# EAGLE design ZEROcard (EAGLE 6.5.0)
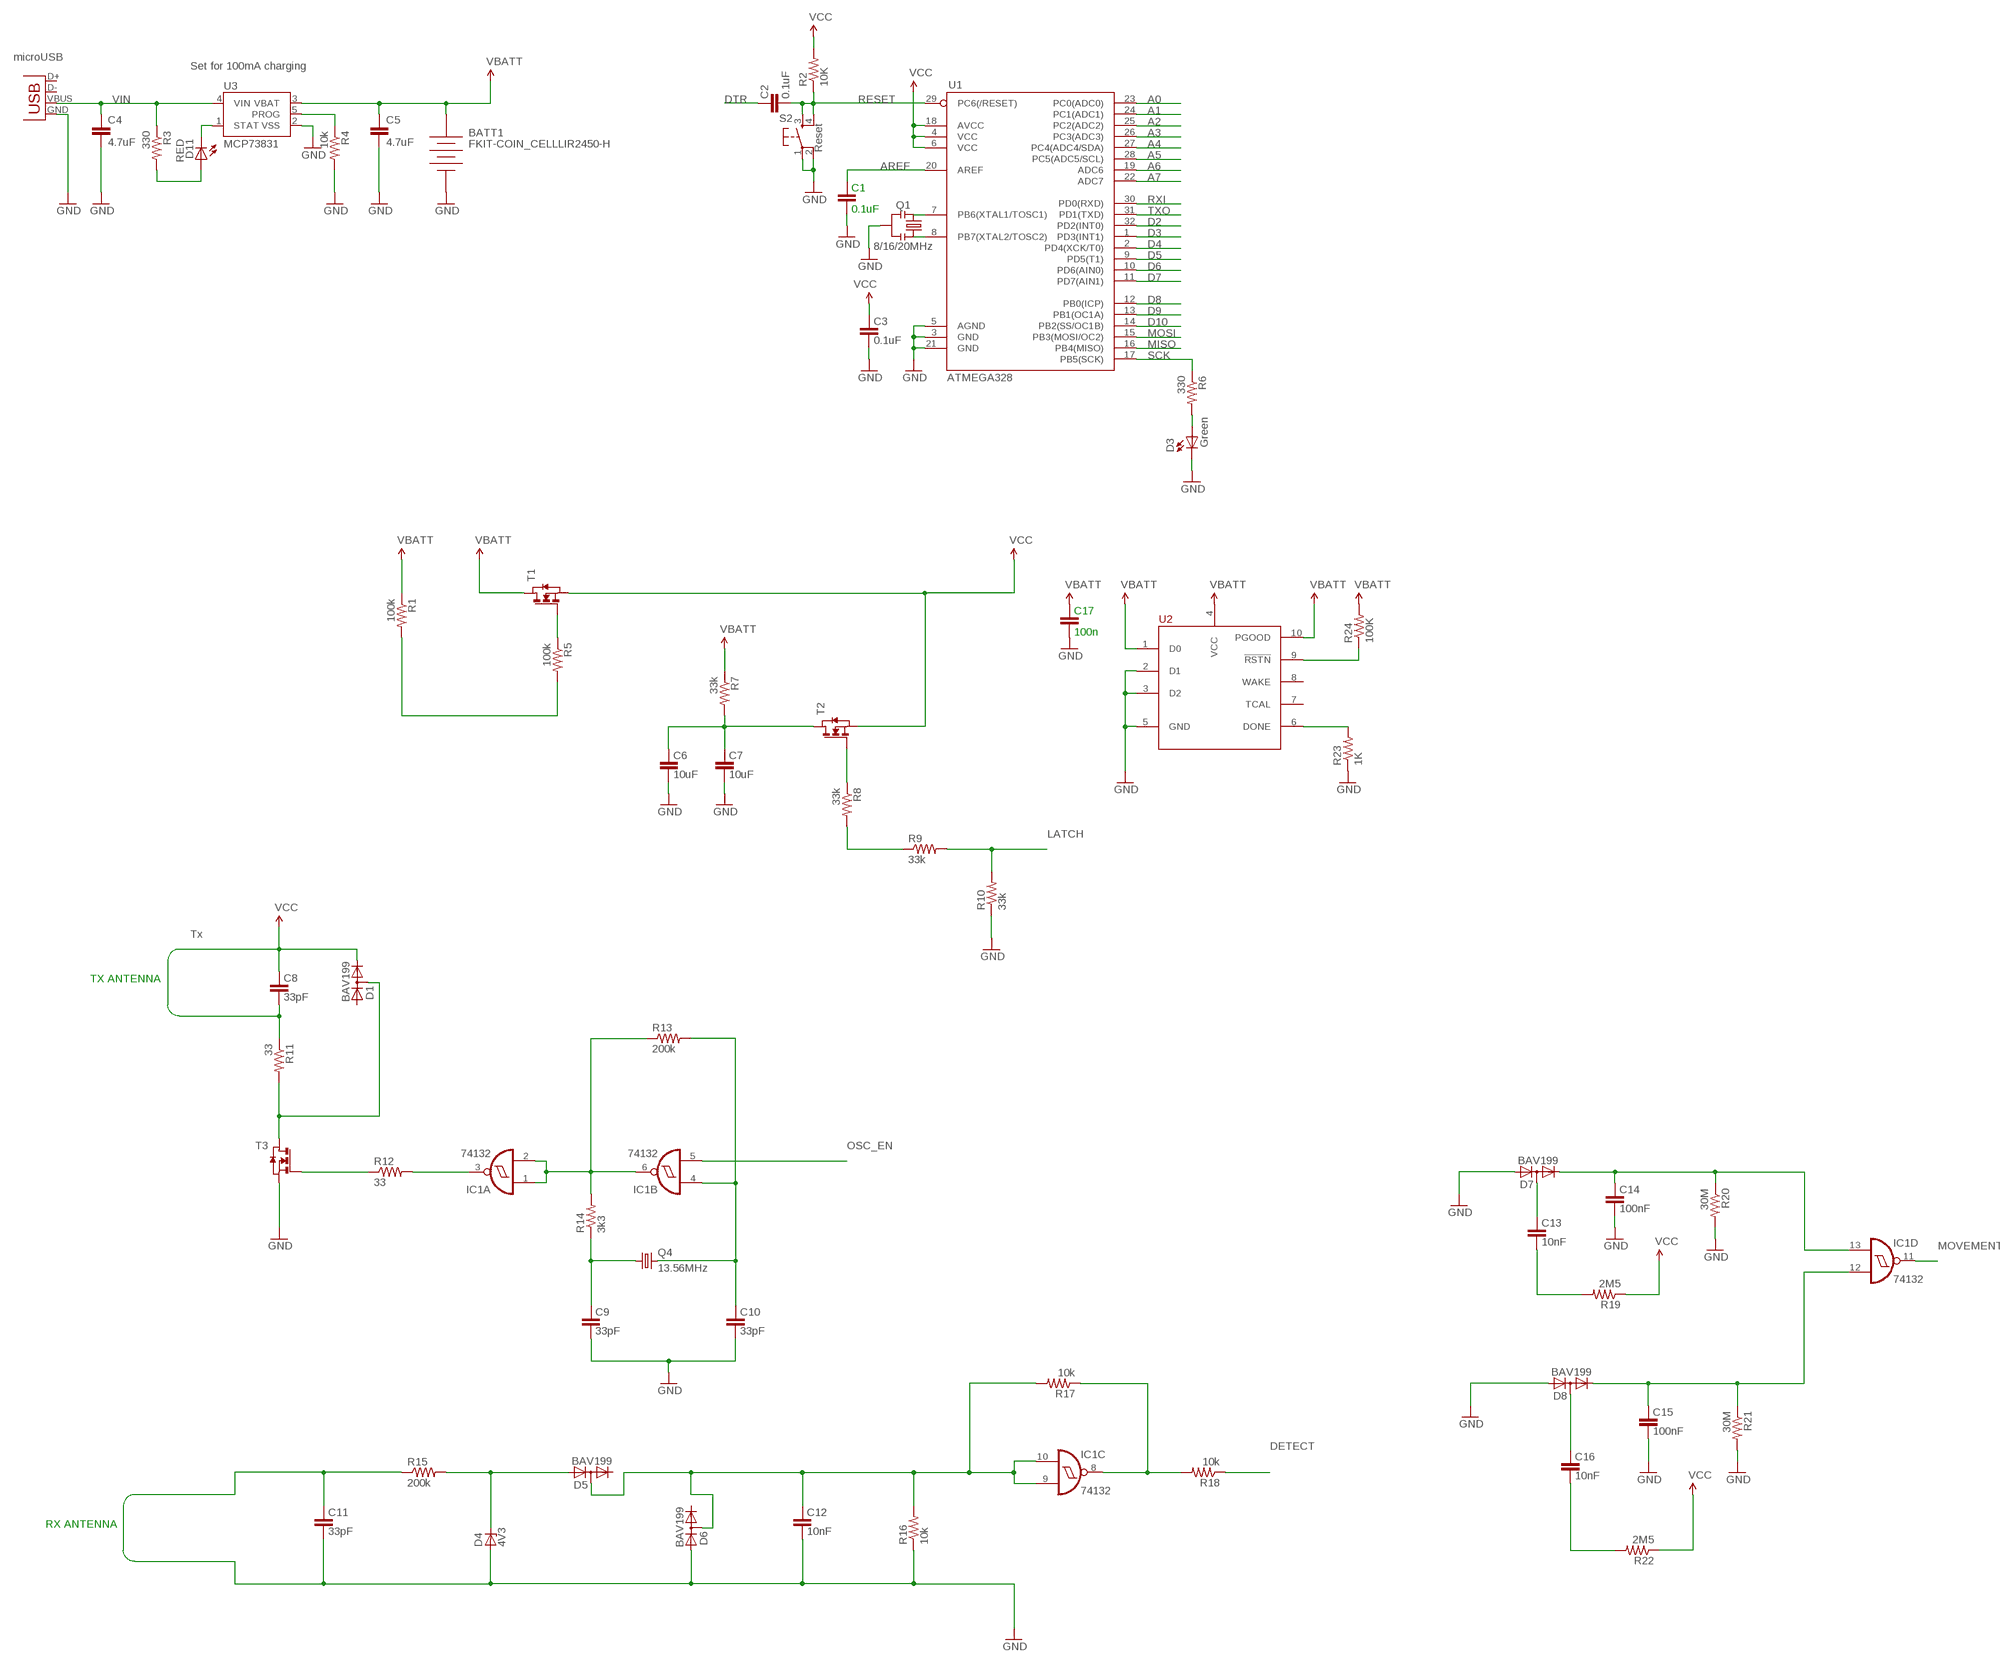
[diagram p0: schematic, sheet 1]

## Parts
BATT1  FKIT-COIN_CELLLIR2450-H  [FKIT-LIR2450-H]
C1  0.1uF  CAP0805  [0805]
C2  0.1uF  CAP0805  [0805]
C3  0.1uF  CAP0805  [0805]
C4  4.7uF  CAP0805  [0805]
C5  4.7uF  CAP0805  [0805]
C6  10uF  CAP0805  [0805]
C7  10uF  CAP0805  [0805]
C8  33pF  CAP0805  [0805]
C9  33pF  CAP0805  [0805]
C10  33pF  CAP0805  [0805]
C11  33pF  CAP0805  [0805]
C12  10nF  CAP0805  [0805]
C13  10nF  CAP0805  [0805]
C14  100nF  CAP0805  [0805]
C15  100nF  CAP0805  [0805]
C16  10nF  CAP0805  [0805]
C17  100n  CAP0805  [0805]
D1  BAV199  [SOT23]
D3  Green  LED0603  [LED-0603]
D4  4V3  ZENER-DIODESOT23  [SOT23]
D5  BAV199  [SOT23]
D6  BAV199  [SOT23]
D7  BAV199  [SOT23]
D8  BAV199  [SOT23]
D11  RED  LED0603  [LED-0603]
IC1  74132  [TSSOP14]
Q1  8/16/20MHz  RESONATORSMD  [RESONATOR-SMD]
Q4  13.56MHz  MC-306  [MC-306]
R1  100k  RESISTOR0805-RES  [0805]
R2  10K  RESISTOR0805-RES  [0805]
R3  330  RESISTOR0805-RES  [0805]
R4  10k  RESISTOR0805-RES  [0805]
R5  100k  RESISTOR0805-RES  [0805]
R6  330  RESISTOR0805-RES  [0805]
R7  33k  RESISTOR0805-RES  [0805]
R8  33k  RESISTOR0805-RES  [0805]
R9  33k  RESISTOR0805-RES  [0805]
R10  33k  RESISTOR0805-RES  [0805]
R11  33  RESISTOR0805-RES  [0805]
R12  33  RESISTOR0805-RES  [0805]
R13  200k  RESISTOR0805-RES  [0805]
R14  3k3  RESISTOR0805-RES  [0805]
R15  200k  RESISTOR0805-RES  [0805]
R16  10k  RESISTOR0805-RES  [0805]
R17  10k  RESISTOR0805-RES  [0805]
R18  10k  RESISTOR0805-RES  [0805]
R19  2M5  RESISTOR0805-RES  [0805]
R20  30M  RESISTOR0805-RES  [0805]
R21  30M  RESISTOR0805-RES  [0805]
R22  2M5  RESISTOR0805-RES  [0805]
R23  1K  RESISTOR0805-RES  [0805]
R24  100K  RESISTOR0805-RES  [0805]
S2  Reset  TAC_SWITCHSMD  [TACTILE_SWITCH_SMD]
T1  NMOSSOT23  [SOT-23]
T2  NMOSSOT23  [SOT-23]
T3  NMOSSOT23  [SOT-23]
U1  ATMEGA328  ATMEGA168  [TQFP32-08]
U2  TPL5000  [MSOP10]
U3  MCP73831  [SOT23-5]
X1  Micro USB  USB-MICROB  [USB-MICROB]

## Nets
3.3V: BATT1.POS C5.1 C8.1 C8.2 C17.2 D1.2(C) R1.1 R7.1 R11.1 R19.1 R22.1 R24.2 T1.1(D) T1.2(S) T2.2(S) U2.1(D0) U2.4(VCC) U2.10(PGOOD) U3.3(VBAT) ; supply symbol labelled VBATT, VCC
A0: U1.23(PC0(ADC0))
A1: U1.24(PC1(ADC1))
A2: U1.25(PC2(ADC2))
A3: U1.26(PC3(ADC3))
A4: U1.27(PC4(ADC4/SDA))
A5: U1.28(PC5(ADC5/SCL))
A6: U1.19(ADC6)
A7: U1.22(ADC7)
AREF: C1.2 U1.20(AREF)
D2: U1.32(PD2(INT0))
D3: U1.1(PD3(INT1))
D4: U1.2(PD4(XCK/T0))
D5: U1.9(PD5(T1))
D6: U1.10(PD6(AIN0))
D7: U1.11(PD7(AIN1))
D8: U1.12(PB0(ICP))
D9: U1.13(PB1(OC1A))
D10: U1.14(PB2(SS/OC1B))
DETECT: R18.1
DTR: C2.2
GND [vcc]: BATT1.NEG C1.1 C3.1 C4.2 C5.2 C6.1 C7.1 C9.1 C10.1 C14.1 C15.1 C17.1 D3.C D7.1(A) D8.1(A) Q1.2 R4.2 R10.1 R20.2 R21.2 R23.1 S2.1 S2.2 T3.2(S) U1.3(GND) U1.5(AGND) U1.21(GND) U2.2(D1) U2.3(D2) U2.5(GND) U3.2(VSS) X1.GND
LATCH: R9.2 R10.2
MISO: U1.16(PB4(MISO))
MOSI: U1.15(PB3(MOSI/OC2))
MOVEMENT: IC1.11(D:O)
N$1: Q1.1 U1.8(PB7(XTAL2/TOSC2))
N$2: Q1.3 U1.7(PB6(XTAL1/TOSC1))
N$3: D11.A R3.2
N$4: R1.2 R5.2
N$7: D3.A R6.2
N$8: R5.1 T1.3(G)
N$9: C6.2 C7.2 R7.2 T2.1(D)
N$10: R8.2 R9.1
N$11: C9.2 Q4.1 R14.1
N$12: R8.1 T2.3(G)
N$13: R23.2 U2.6(DONE)
N$14: D1.3(AC) R11.2 T3.1(D)
N$15: D4.3(C) D5.1(A) R15.2
N$16: R12.1 T3.3(G)
N$17: IC1.3(A:O) R12.2
N$18: IC1.1(A:I0) IC1.2(A:I1) IC1.6(B:O) R13.1 R14.2
N$19: C13.2 D7.3(AC)
N$20: C10.2 IC1.4(B:I0) Q4.4 R13.2
N$21: C12.2 D5.3(AC) D6.3(AC) IC1.9(C:I1) IC1.10(C:I0) R16.2 R17.2
N$22: C13.1 R19.2
N$23: C14.2 D7.2(C) IC1.13(D:I0) R20.1
N$24: IC1.8(C:O) R17.1 R18.2
N$25: C15.2 D8.2(C) IC1.12(D:I1) R21.1
N$26: C16.2 D8.3(AC)
N$27: C16.1 R22.2
N$28: R24.1 U2.9(!RSTN)
OSC_EN: IC1.5(B:I1)
PROG: R4.1 U3.5(PROG)
RESET: C2.1 R2.1 S2.3 S2.4 U1.29(PC6(/RESET))
RX [vcc]: C11.1 C11.2 C12.1 D4.1(A) D6.1(A) R15.1 R16.1 ; supply symbol labelled GND
RXI: U1.30(PD0(RXD))
SCK: R6.1 U1.17(PB5(SCK))
STAT: D11.C U3.1(STAT)
TXO: U1.31(PD1(TXD))
VCC: C3.2 R2.2 U1.4(VCC) U1.6(VCC) U1.18(AVCC)
VIN: C4.1 R3.1 U3.4(VIN) X1.VBUS
Unconnected: D1.1(A) D5.2(C) D6.2(C) U2.7(TCAL) U2.8(WAKE) X1.D+ X1.D-

## Notes on the sheet
- microUSB
- Set for 100mA charging
- Tx
- TX ANTENNA
- RX ANTENNA

## Power pins joined to a net without a drawn wire
GND: IC1.7(P:GND)
VCC: IC1.14(P:VCC)

## Library data of the parts
BATT1 = SparkFun-Electromechanical:FKIT-COIN_CELL: Fabrick.it Coin Cell Holder Coin cell holder for 24.5mm rechargable coin cell
C1-C17 = SparkFun:CAP: Capacitor Standard 0603 ceramic capacitor, and 0.1" leaded capacitor.
D1 D5-D8 = diode:BAV199: DIODE low-leakage double diode
D3 D11 = SparkFun:LED: LEDs Standard schematic elements and footprints for 5mm, 3mm, 1206, and 0603 sized LEDs. 5mm - Spark Fun Electronics SKU : COM-00529 (and others)
D4 = diode:ZENER-DIODE: Z-Diode
IC1 = 74xx-eu:74*132: Quad 2-input NAND schmitt trigger
Q1 = SparkFun:RESONATOR: Resonator Small SMD resonator. This is the itty bitty 10/20MHz resonators with built in caps. CSTCE10M0G55 and CSTCE20M0V53. Footprint has been reviewed closely but hasn't been tested yet.
Q4 = crystal:MC-306: kHz RANGE CRYSTAL UNIT SMD Source: MC-306_405_406_E07X.PDF Homepage <http://www.epsontoyocom.co.jp>; MPN: MC-306 60.0KHZ 100PPM ,12.5PF; OC_FARNELL: 1278040; OC_NEWARK: 31M5576
R1-R24 = SparkFun:RESISTOR: Resistor Basic schematic elements and footprints for 0603, 1206, and PTH resistors.
S2 = SparkFun:TAC_SWITCH: Momentary Switch Button commonly used for reset or general input. Spark Fun Electronics SKU : COM-00097
T1-T3 = zetex:NMOSSOT23: MOS FET; OC_FARNELL: unknown; OC_NEWARK: unknown
U1 = SparkFun:ATMEGA168
U2 = reozenLib:TPL5000: Timer Low Power (2, 4, 8, ... 64 seconds wake up time) http://www.ti.com/lit/ds/symlink/tpl5000.pdf
U3 = SparkFun:MCP73831: Microchip's MCP73831 Miniature single cell, fully integrated Li-Ion, Li-polymer charge management controller http://ww1.microchip.com/downloads/en/DeviceDoc/21984a.pdf
X1 = SparkFun:USB: USB Connectors USB-B-PTH is fully proven SKU : PRT-00139 USB-miniB is fully proven SKU : PRT-00587 USB-A-PCB is untested. USB-A-H is throughly reviewed, but untested. Spark Fun Electronics SKU : PRT-00437 USB-B-SMT is throughly reviewed, but untested. Needs silkscreen touching up. USB-A-S has not been used/tested USB-MB-H has not been used/tested

## Net classes
1 vcc: width 0.254 mm

## Board
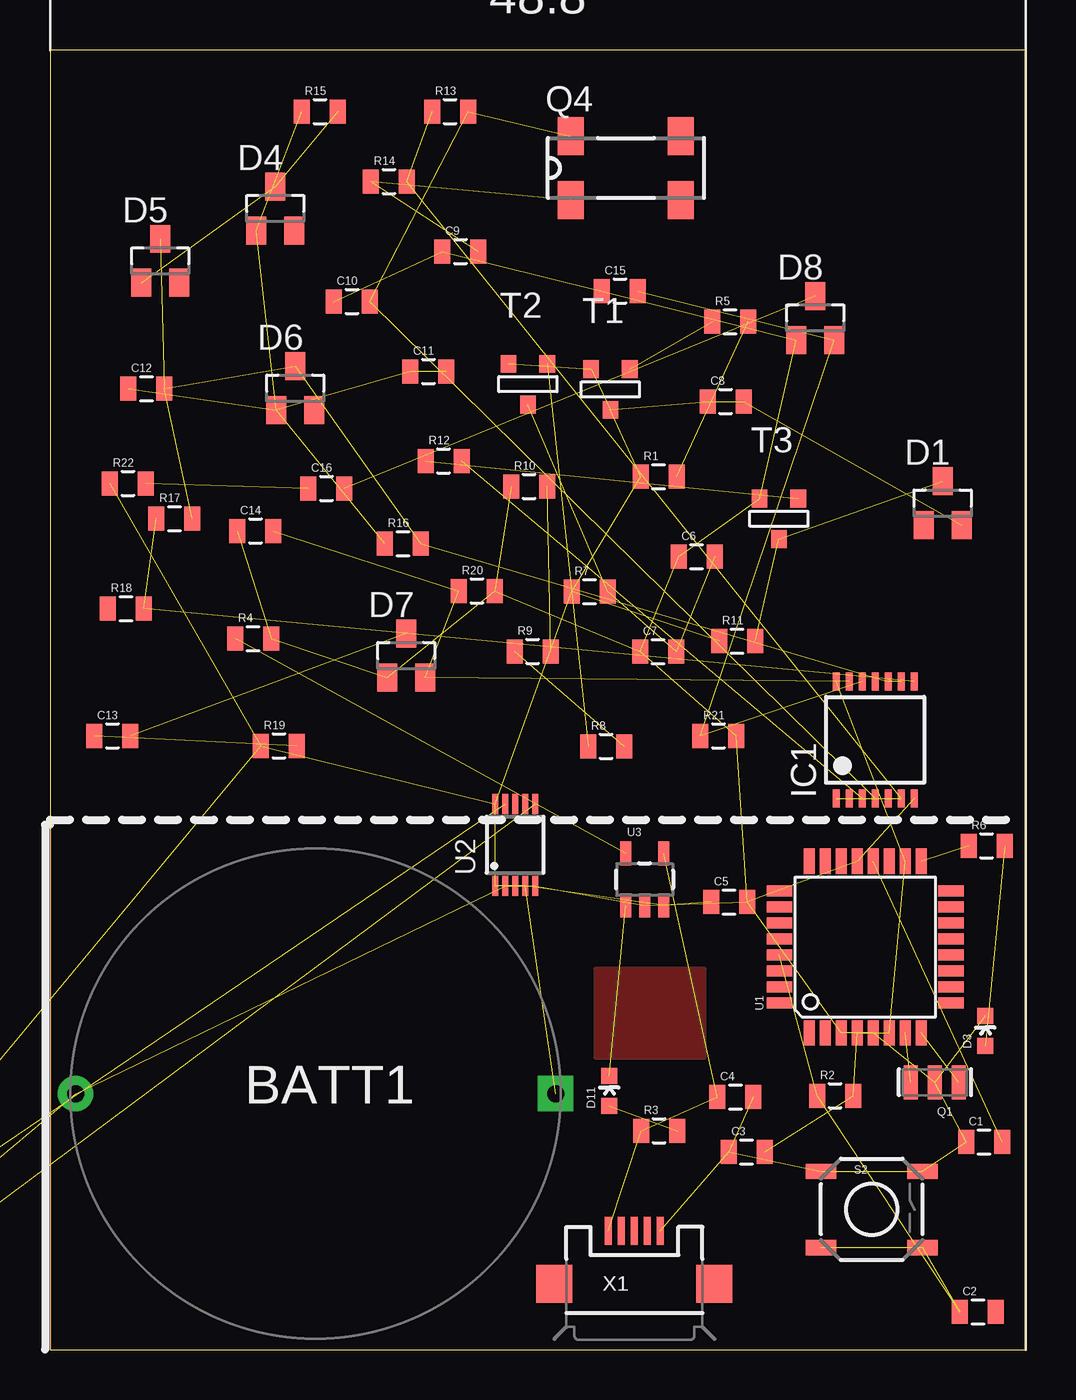
[diagram p1: board, top side]

Size 48.8 x 65 mm. Coordinates in mm from the lower left corner, seen from the top.
Outline: 0,0 48.8,0 48.8,65 0,65 0,0
Copper layers (1*16): Top 0.035mm / dielectric 1.5mm / Bottom 0.035mm
Design rules "default": minimum track width 10mil, minimum drill 24mil, track to track 8mil, track to pad 8mil, pad to pad 8mil, via to via 8mil, smd to smd 8mil, copper to edge 40mil, drill to drill 8mil, minimum pad ring 10mil, minimum via ring 8mil, stop-mask expansion 4mil, vias tented up to drill 0mil, thermal gap 10mil

### Footprints (pad centres in the part's own frame; a part is rotated, then mirrored left to right if it is on the bottom)
FKIT-LIR2450-H = drill 0.85 pad 1.778: NEG -12,0 | drill 0.85 pad 1.778 square: POS 12,0
0805 = smd 0.8 x 1.2: 1 -0.9,0; 2 0.9,0
SOT23 = smd 1 x 1.4: 1 -0.95,-1.1; 2 0.95,-1.1; 3 0,1.1
LED-0603 = smd 0.8 x 0.8: A 0,-0.75; C 0,0.75
TSSOP14 = smd 0.35 x 0.9: 1 -1.95,-2.925; 2 -1.3,-2.925; 3 -0.65,-2.925; 4 0,-2.925; 5 0.65,-2.925; 6 1.3,-2.925; 7 1.95,-2.925; 8 1.95,2.925; 9 1.3,2.925; 10 0.65,2.925; 11 0,2.925; 12 -0.65,2.925; 13 -1.3,2.925; 14 -1.95,2.925
RESONATOR-SMD = smd 0.7 x 1.7: 1 -1.2,0; 2 0,0; 3 1.2,0
MC-306 = smd 1.3 x 1.9: 1 -2.75,-1.6; 2 2.75,-1.6; 3 2.75,1.6; 4 -2.75,1.6
TACTILE_SWITCH_SMD = smd 1.524 x 0.762: 1 -2.54,1.905; 2 2.54,1.905; 3 -2.54,-1.905; 4 2.54,-1.905
SOT-23 = smd 0.787 x 0.889: 1 0.025,-1.016; 2 -0.94,1.016; 3 0.991,1.016
TQFP32-08 = smd 1.27 x 0.559: 1 -4.293,2.8; 2 -4.293,2; 3 -4.293,1.2; 4 -4.293,0.4; 5 -4.293,-0.4; 6 -4.293,-1.2; 7 -4.293,-2; 8 -4.293,-2.8; 17 4.293,-2.8; 18 4.293,-2; 19 4.293,-1.2; 20 4.293,-0.4; 21 4.293,0.4; 22 4.293,1.2; 23 4.293,2; 24 4.293,2.8 | smd 0.559 x 1.27: 9 -2.8,-4.293; 10 -2,-4.293; 11 -1.2,-4.293; 12 -0.4,-4.293; 13 0.4,-4.293; 14 1.2,-4.293; 15 2,-4.293; 16 2.8,-4.293; 25 2.8,4.293; 26 2,4.293; 27 1.2,4.293; 28 0.4,4.293; 29 -0.4,4.293; 30 -1.2,4.293; 31 -2,4.293; 32 -2.8,4.293
MSOP10 = smd 0.3 x 1: 1 -1,-2.05; 2 -0.5,-2.05; 3 0,-2.05; 4 0.5,-2.05; 5 1,-2.05; 6 1,2.05; 7 0.5,2.05; 8 0,2.05; 9 -0.5,2.05; 10 -1,2.05
SOT23-5 = smd 0.55 x 1.2: 1 -0.95,-1.3; 2 0,-1.3; 3 0.95,-1.3; 4 0.95,1.3; 5 -0.95,1.3
USB-MICROB = smd 0.35 x 1.4: D+ 0,2.65; D- -0.65,2.65; GND 1.3,2.65; ID 0.65,2.65; VBUS -1.3,2.65 | smd 1.8 x 1.9: MT1 -4,0; MT2 4,0

### Placement (x,y rotation side)
BATT1  13.28,12.8 0 top
C1  46.7,10.38 0 top
C2  46.39,1.88 0 top
C3  34.83,9.88 0 top
C4  34.27,12.63 0 top
C5  33.96,22.38 0 top
C6  32.34,39.66 0 top
C7  30.41,34.91 0 top
C8  33.78,47.42 0 top
C9  20.52,54.92 0 top
C10  15.1,52.42 0 top
C11  18.92,48.92 0 top
C12  4.82,48.06 0 top
C13  3.12,30.69 0 top
C14  10.27,40.94 0 top
C15  28.5,52.94 0 top
C16  13.82,43.07 0 top
C17  -17,1.75 0 top  (outside the outline)
D1  44.63,42.34 0 top
D3  46.77,15.94 0 top
D4  11.27,57.07 0 top
D5  5.51,54.45 0 top
D6  12.27,48.08 0 top
D7  17.82,34.71 0 top
D8  38.27,51.59 0 top
D11  27.96,12.94 0 top
IC1  41.25,30.5 0 top
Q1  44.24,13.37 180 top
Q4  28.8,59.09 0 top
R1  30.43,43.66 0 top
R2  39.26,12.69 0 top
R3  30.45,10.94 0 top
R4  10.16,35.56 0 top
R5  34.01,51.41 0 top
R6  46.83,25.19 0 top
R7  26.98,37.91 0 top
R8  27.81,30.17 0 top
R9  24.14,34.92 0 top
R10  23.96,43.17 0 top
R11  34.36,35.44 0 top
R12  19.68,44.45 0 top
R13  20.01,61.92 0 top
R14  16.95,58.42 0 top
R15  13.49,61.92 0 top
R16  17.64,40.31 0 top
R17  6.22,41.56 0 top
R18  3.79,37.06 0 top
R19  11.45,30.19 0 top
R20  21.34,37.94 0 top
R21  33.42,30.69 0 top
R22  3.9,43.32 0 top
R23  -11,1.75 0 top  (outside the outline)
R24  -14,1.75 0 top  (outside the outline)
S2  41.08,7.01 0 top
T1  28,48.02 0 top
T2  23.87,48.28 0 top
T3  36.42,41.55 0 top
U1  40.76,20.13 90 top
U2  23.25,25.25 0 top
U3  29.73,23.51 0 top
X1  29.22,3.28 0 top

### Tracks (layer width: path | path; a pad name or v marks a point on that pad's centre or on a via)
3.3V  (18 unrouted)
AREF  (1 unrouted)
GND  (32 unrouted)
LATCH  (1 unrouted)
N$1  (1 unrouted)
N$2  (1 unrouted)
N$3  (1 unrouted)
N$4  (1 unrouted)
N$5
  pour Top: 27.27,19.05 27.27,14.61 32.73,14.61 32.73,19.05
N$7  (1 unrouted)
N$8  (1 unrouted)
N$9  (3 unrouted)
N$10  (1 unrouted)
N$11  (2 unrouted)
N$12  (1 unrouted)
N$13  (1 unrouted)
N$14  (2 unrouted)
N$15  (2 unrouted)
N$16  (1 unrouted)
N$17  (1 unrouted)
N$18  (4 unrouted)
N$19  (1 unrouted)
N$20  (3 unrouted)
N$21  (6 unrouted)
N$22  (1 unrouted)
N$23  (3 unrouted)
N$24  (2 unrouted)
N$25  (3 unrouted)
N$26  (1 unrouted)
N$27  (1 unrouted)
N$28  (1 unrouted)
PROG  (1 unrouted)
RESET  (4 unrouted)
RX  (6 unrouted)
SCK  (1 unrouted)
STAT  (1 unrouted)
VCC  (5 unrouted)
VIN  (3 unrouted)